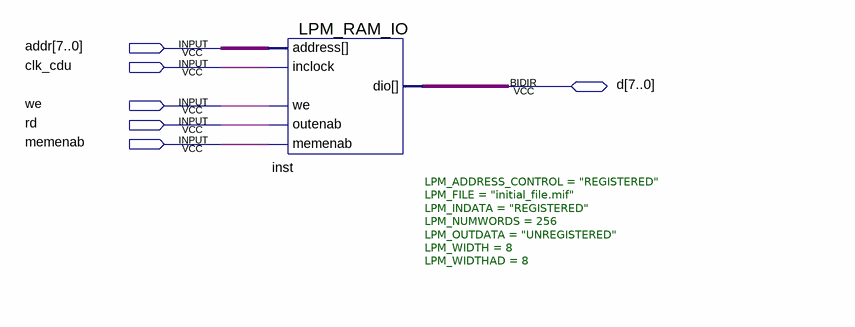
[diagram p0: schematic sheet]
// Quartus schematic exp_ram2.bdf as structural Verilog: 1 symbols, 6 pins
module exp_ram2 (
  input  [7:0] addr,
  input  clk_cdu,
  input  we,
  input  rd,
  input  memenab,
  inout  [7:0] d
);

  LPM_RAM_IO #(.LPM_ADDRESS_CONTROL("REGISTERED"), .LPM_FILE("initial_file.mif"), .LPM_INDATA("REGISTERED"), .LPM_NUMWORDS(256), .LPM_OUTDATA("UNREGISTERED"), .LPM_WIDTH(8), .LPM_WIDTHAD(8)) inst (
    .address(addr), .memenab(memenab), .inclock(clk_cdu), .we(we), .outenab(rd), .dio(d));
endmodule
